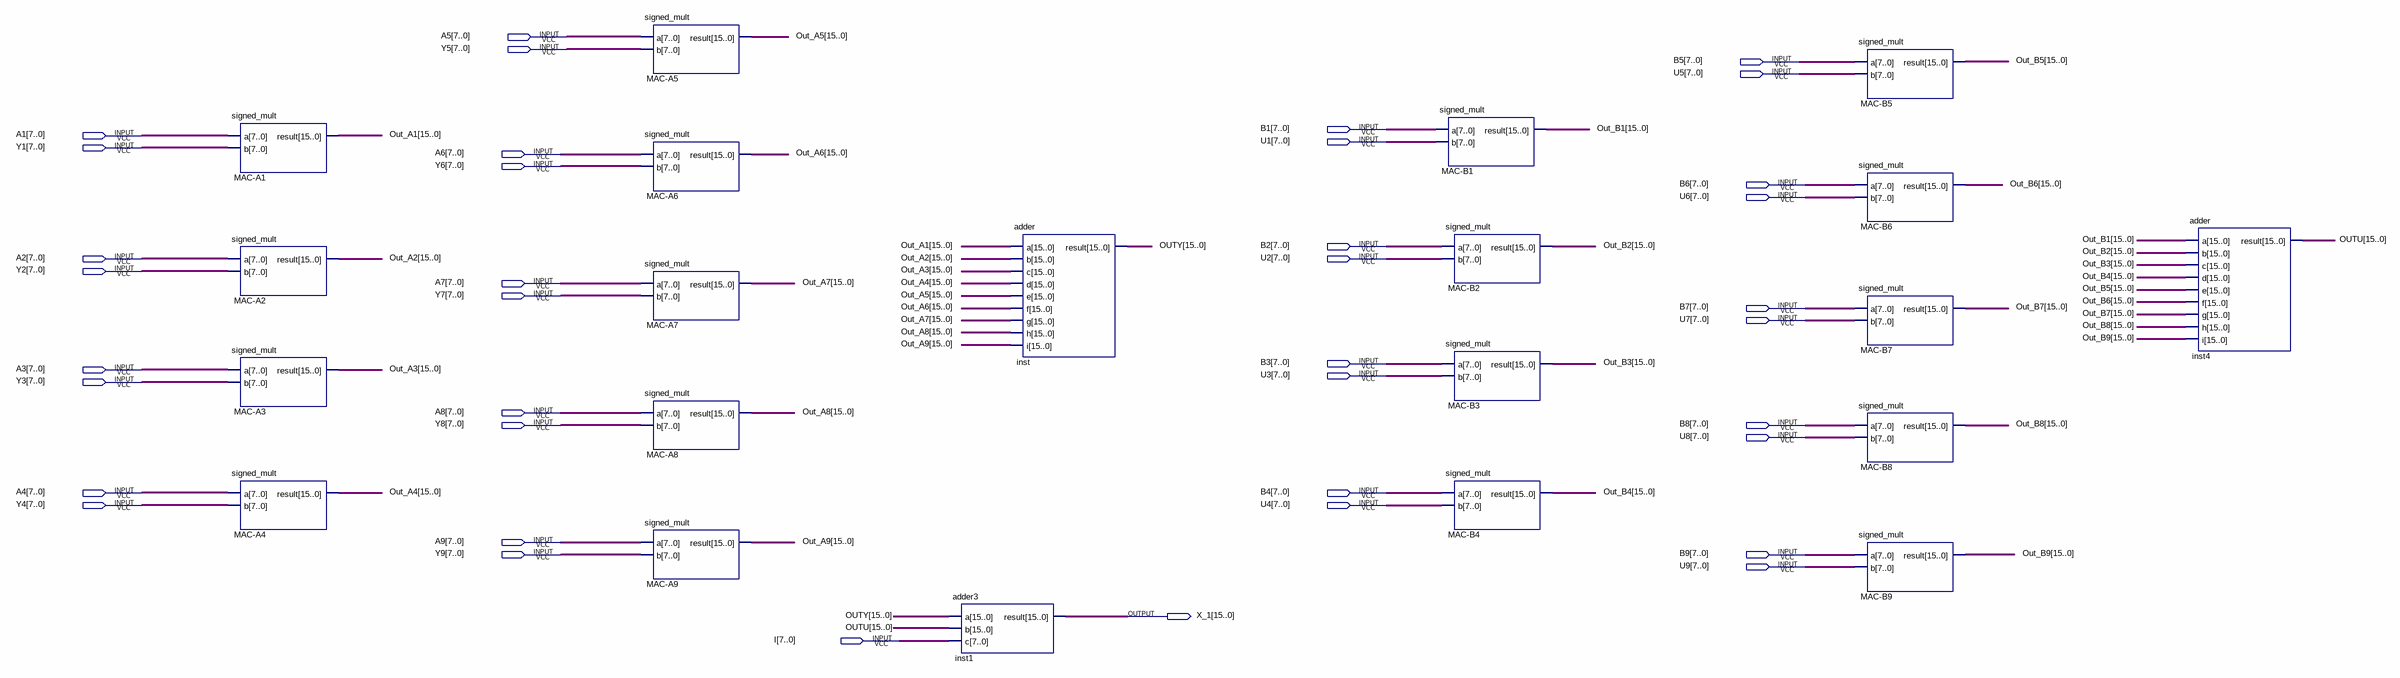
[diagram p0: schematic sheet]
// Quartus schematic Naive_EQ1.bdf as structural Verilog: 21 symbols, 38 pins
module Naive_EQ1 (
  input  [7:0] A5,
  input  [7:0] Y5,
  input  [7:0] B5,
  input  [7:0] U5,
  input  [7:0] B1,
  input  [7:0] A1,
  input  [7:0] U1,
  input  [7:0] Y1,
  input  [7:0] A6,
  input  [7:0] Y6,
  input  [7:0] B6,
  input  [7:0] U6,
  input  [7:0] B2,
  input  [7:0] A2,
  input  [7:0] U2,
  input  [7:0] Y2,
  input  [7:0] A7,
  input  [7:0] Y7,
  input  [7:0] B7,
  input  [7:0] U7,
  input  [7:0] B3,
  input  [7:0] A3,
  input  [7:0] U3,
  input  [7:0] Y3,
  input  [7:0] A8,
  input  [7:0] Y8,
  input  [7:0] B8,
  input  [7:0] U8,
  input  [7:0] A4,
  input  [7:0] B4,
  input  [7:0] Y4,
  input  [7:0] U4,
  input  [7:0] A9,
  input  [7:0] Y9,
  input  [7:0] B9,
  input  [7:0] U9,
  input  [7:0] I,
  output [15:0] X_1
);

  wire [15:0] Out_A1, Out_A2, Out_A3, Out_A4, Out_A5, Out_A6, Out_A7, Out_A8, Out_A9, Out_B1, Out_B2, Out_B3,
       Out_B4, Out_B5, Out_B6, Out_B7, Out_B8, Out_B9, OUTU, OUTY;

  signed_mult \MAC-A1  (.a(A1), .b(Y1), .result(Out_A1));
  signed_mult \MAC-A2  (.a(A2), .b(Y2), .result(Out_A2));
  signed_mult \MAC-A3  (.a(A3), .b(Y3), .result(Out_A3));
  signed_mult \MAC-A4  (.a(A4), .b(Y4), .result(Out_A4));
  signed_mult \MAC-A5  (.a(A5), .b(Y5), .result(Out_A5));
  signed_mult \MAC-A6  (.a(A6), .b(Y6), .result(Out_A6));
  signed_mult \MAC-A7  (.a(A7), .b(Y7), .result(Out_A7));
  signed_mult \MAC-A8  (.a(A8), .b(Y8), .result(Out_A8));
  signed_mult \MAC-A9  (.a(A9), .b(Y9), .result(Out_A9));
  adder3 inst1 (.a(OUTY), .b(OUTU), .c(I), .result(X_1));
  adder inst (
    .a(Out_A1), .b(Out_A2), .c(Out_A3), .d(Out_A4), .e(Out_A5), .f(Out_A6), .g(Out_A7), .h(Out_A8),
    .i(Out_A9), .result(OUTY));
  signed_mult \MAC-B1  (.a(B1), .b(U1), .result(Out_B1));
  signed_mult \MAC-B2  (.a(B2), .b(U2), .result(Out_B2));
  signed_mult \MAC-B3  (.a(B3), .b(U3), .result(Out_B3));
  signed_mult \MAC-B4  (.a(B4), .b(U4), .result(Out_B4));
  signed_mult \MAC-B5  (.a(B5), .b(U5), .result(Out_B5));
  signed_mult \MAC-B6  (.a(B6), .b(U6), .result(Out_B6));
  signed_mult \MAC-B7  (.a(B7), .b(U7), .result(Out_B7));
  signed_mult \MAC-B8  (.a(B8), .b(U8), .result(Out_B8));
  signed_mult \MAC-B9  (.a(B9), .b(U9), .result(Out_B9));
  adder inst4 (
    .a(Out_B1), .b(Out_B2), .c(Out_B3), .d(Out_B4), .e(Out_B5), .f(Out_B6), .g(Out_B7), .h(Out_B8),
    .i(Out_B9), .result(OUTU));
endmodule
